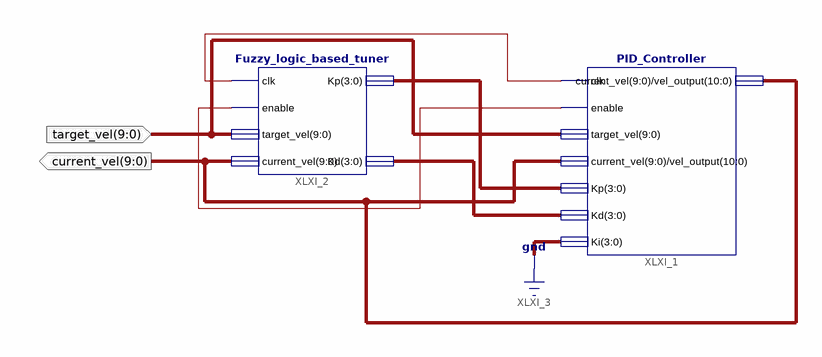
[diagram p0: schematic sheet 1]
// Xilinx ISE schematic Main_module.sch (spartan3e) as structural Verilog: 2 symbols, 2 ports
module Main_module (
  input  [9:0] target_vel,
  output [9:0] current_vel
);

  wire XLXN_4, XLXN_5;
  wire [3:0] XLXN_1, XLXN_3;

  PID_Controller XLXI_1 (
    .clk(XLXN_4), .enable(XLXN_5), .target_vel(target_vel), .current_vel(current_vel), .Kp(XLXN_3),
    .Kd(XLXN_1), .Ki(4'b0000), .vel_output(current_vel));
  Fuzzy_logic_based_tuner XLXI_2 (
    .clk(XLXN_4), .enable(XLXN_5), .target_vel(target_vel), .current_vel(current_vel), .Kp(XLXN_3),
    .Kd(XLXN_1));
endmodule
